# Altium schematic sheet Buffers.SchDoc
size 297 x 209 mm; SheetNumber: 14; SheetTotal: 29
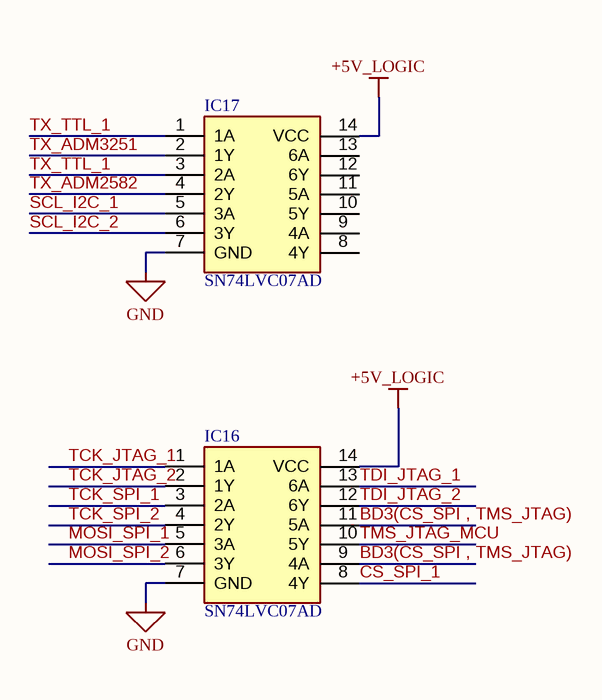
[diagram p0: Buffers.SchDoc]

## Parts
IC16  SN74LVC07AD  [SOIC127P600X175-14N]
IC17  SN74LVC07AD  [SOIC127P600X175-14N]

## Nets
+5V_LOGIC: IC16.14(VCC) IC17.14(VCC)
GND: IC16.7(GND) IC17.7(GND)
BD3(CS_SPI , TMS_JTAG): IC16.9(4A) IC16.11(5A)
CS_SPI_1: IC16.8(4Y)
MOSI_SPI_1: IC16.5(3A)
MOSI_SPI_2: IC16.6(3Y)
SCL_I2C_1: IC17.5(3A)
SCL_I2C_2: IC17.6(3Y)
TCK_JTAG_1: IC16.1(1A)
TCK_JTAG_2: IC16.2(1Y)
TCK_SPI_1: IC16.3(2A)
TCK_SPI_2: IC16.4(2Y)
TDI_JTAG_1: IC16.13(6A)
TDI_JTAG_2: IC16.12(6Y)
TMS_JTAG_MCU: IC16.10(5Y)
TX_ADM2582: IC17.4(2Y)
TX_ADM3251: IC17.2(1Y)
TX_TTL_1: IC17.1(1A) IC17.3(2A)

Not connected (* = marked no-connect by the designer): IC17 8(4Y) 9(4A) 10(5Y) 11(5A) 12(6Y) 13(6A)

## Notes on the sheet
- Drawn
- Name
- Date
- Drawing Title
- Checked
- Drawing No.
- Approved
- Size
- A4
- Ver.
- Rev.
- Sheet
- Of

## Library data of the parts
IC16 IC17 = SN74LVC07AD: Integrated Circuit; Manufacturer_Name: Texas Instruments; Datasheet Link: http://www.ti.com/lit/ds/symlink/sn74lvc07a.pdf; Height: 1.75mm; Manufacturer_Part_Number: SN74LVC07AD; Mouser Part Number: 595-SN74LVC07AD; Mouser Price/Stock: https://www.mouser.co.uk/ProductDetail/Texas-Instruments/SN74LVC07AD?qs=8yeEWhuAOtMkbU1H3MsIVg%3D%3D; Arrow Part Number: SN74LVC07AD; Arrow Price/Stock: https://www.arrow.com/en/products/sn74lvc07ad/texas-instruments?region=nac